# EAGLE design working (EAGLE 7.7.0)
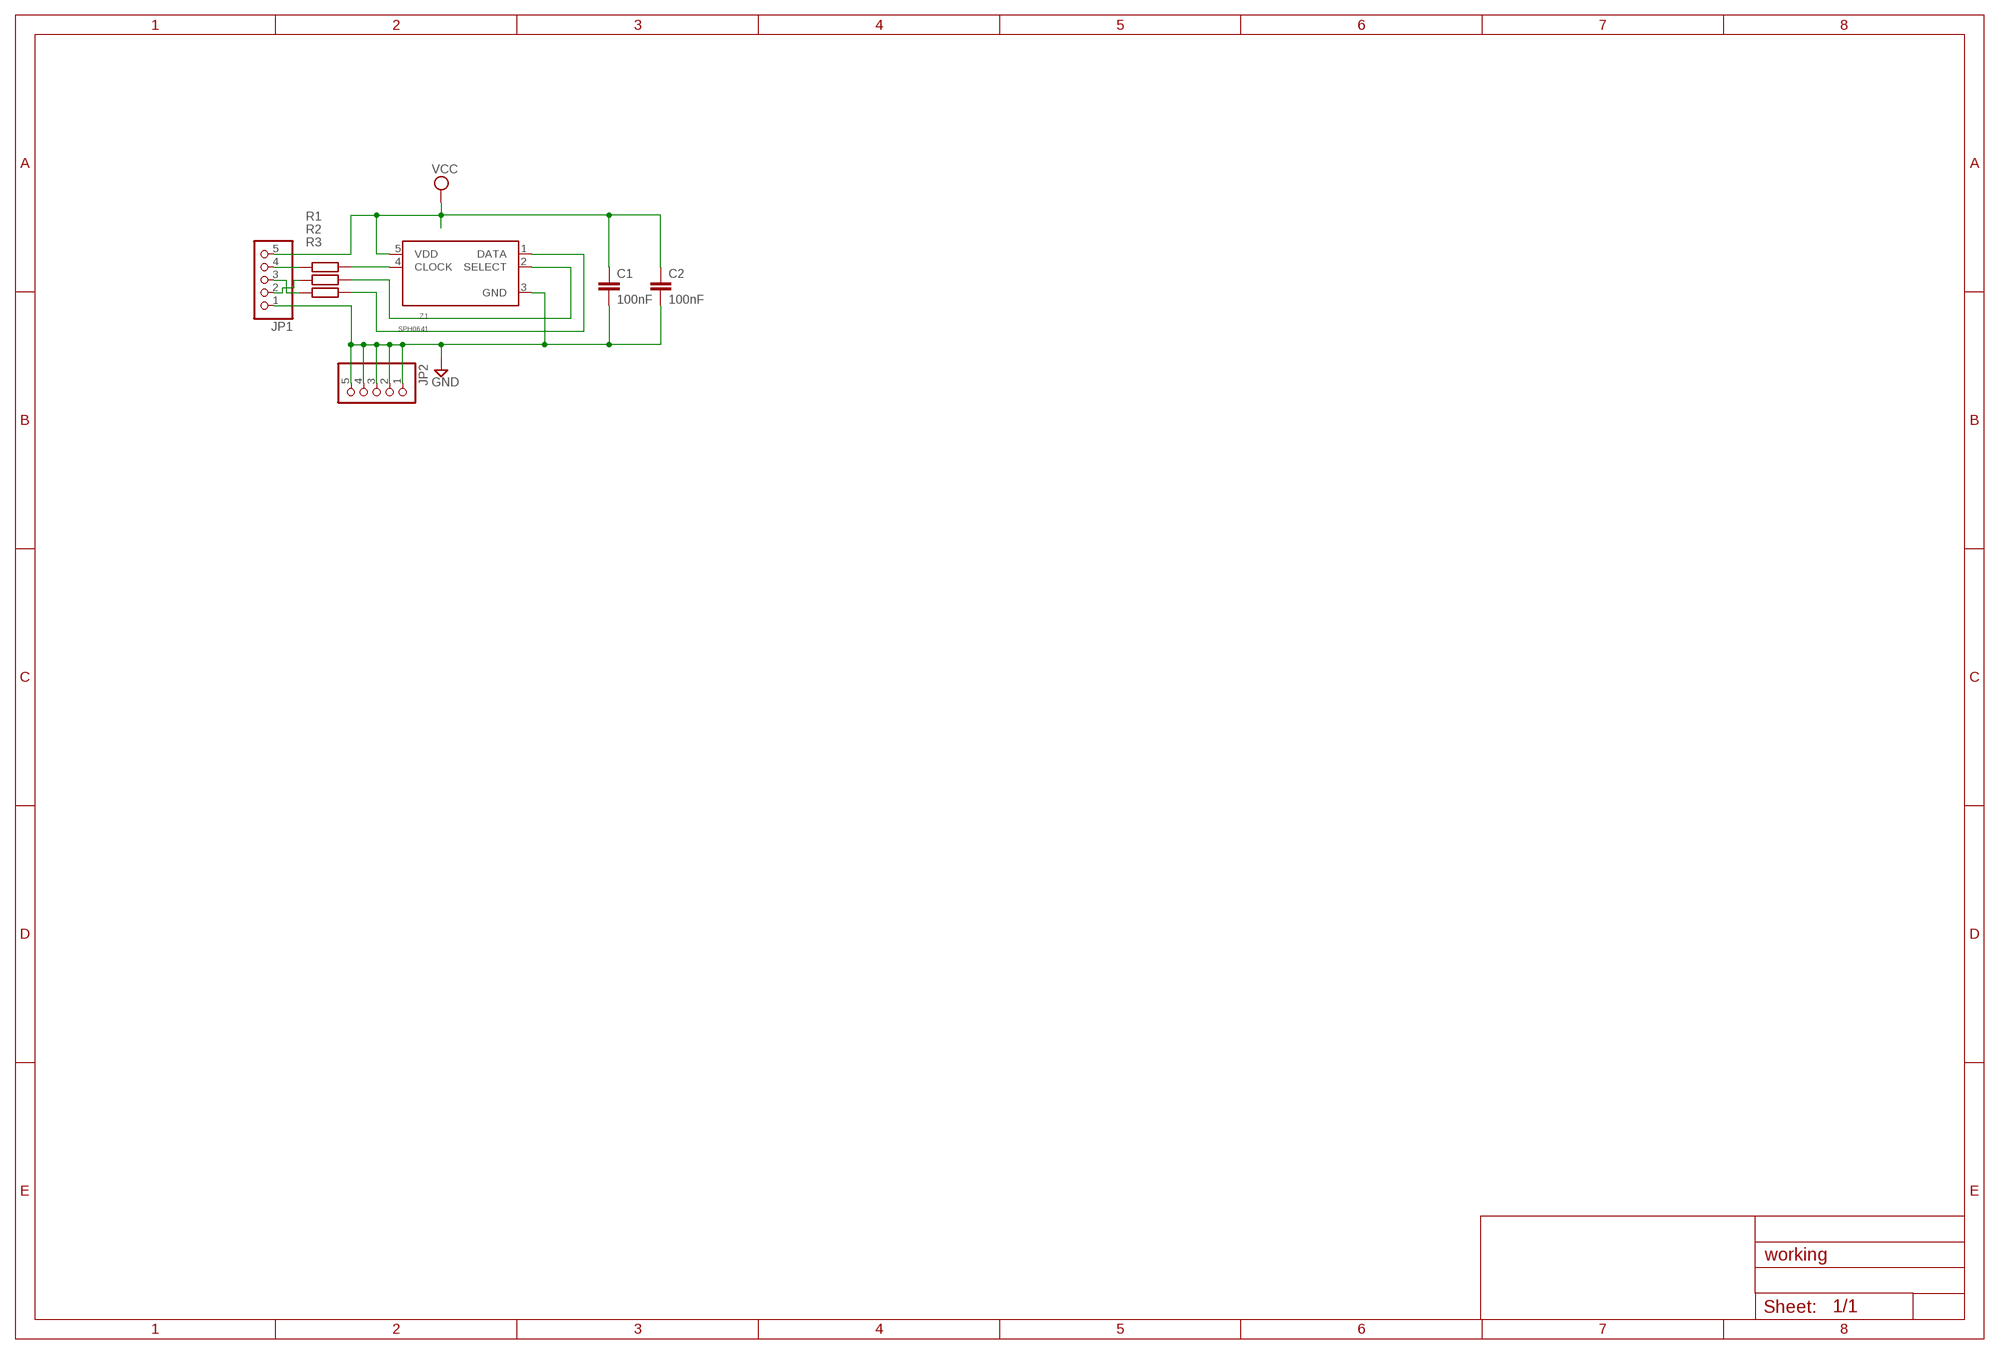
[diagram p0: schematic, sheet 1]

## Parts
C1  100nF  C-EUC0805K  [C0805K]
C2  100nF  C-EUC0805K  [C0805K]
JP1  PINHD-1X5  [1X05]
JP2  PINHD-1X5  [1X05]
R1  R-EU_R0603  [R0603]
R2  R-EU_R0603  [R0603]
R3  R-EU_R0603  [R0603]
Z1  SPH0641  [SPH0641]

## Nets
GND: C1.2 C2.2 JP1.1 JP2.1 JP2.2 JP2.3 JP2.4 JP2.5 Z1.3(GND)
N$1: JP1.4 R1.1
N$2: JP1.3 R3.1
N$3: JP1.2 R2.1
N$5: R3.2 Z1.1(DATA)
N$6: R2.2 Z1.2(SELECT)
N$7: R1.2 Z1.4(CLOCK)
VCC: C1.1 C2.1 JP1.5 Z1.5(VDD)

## Library data of the parts
C1 C2 = rcl:C-EU: CAPACITOR, European symbol
JP1 JP2 = pinhead:PINHD-1X5: PIN HEADER
R1-R3 = rcl:R-EU_: RESISTOR, European symbol
Z1 = SPH0641:SPH0641: Digital Zero-Height SiSonicTM Microphone With Multi-Mode And Ultrasonic Support

## Board
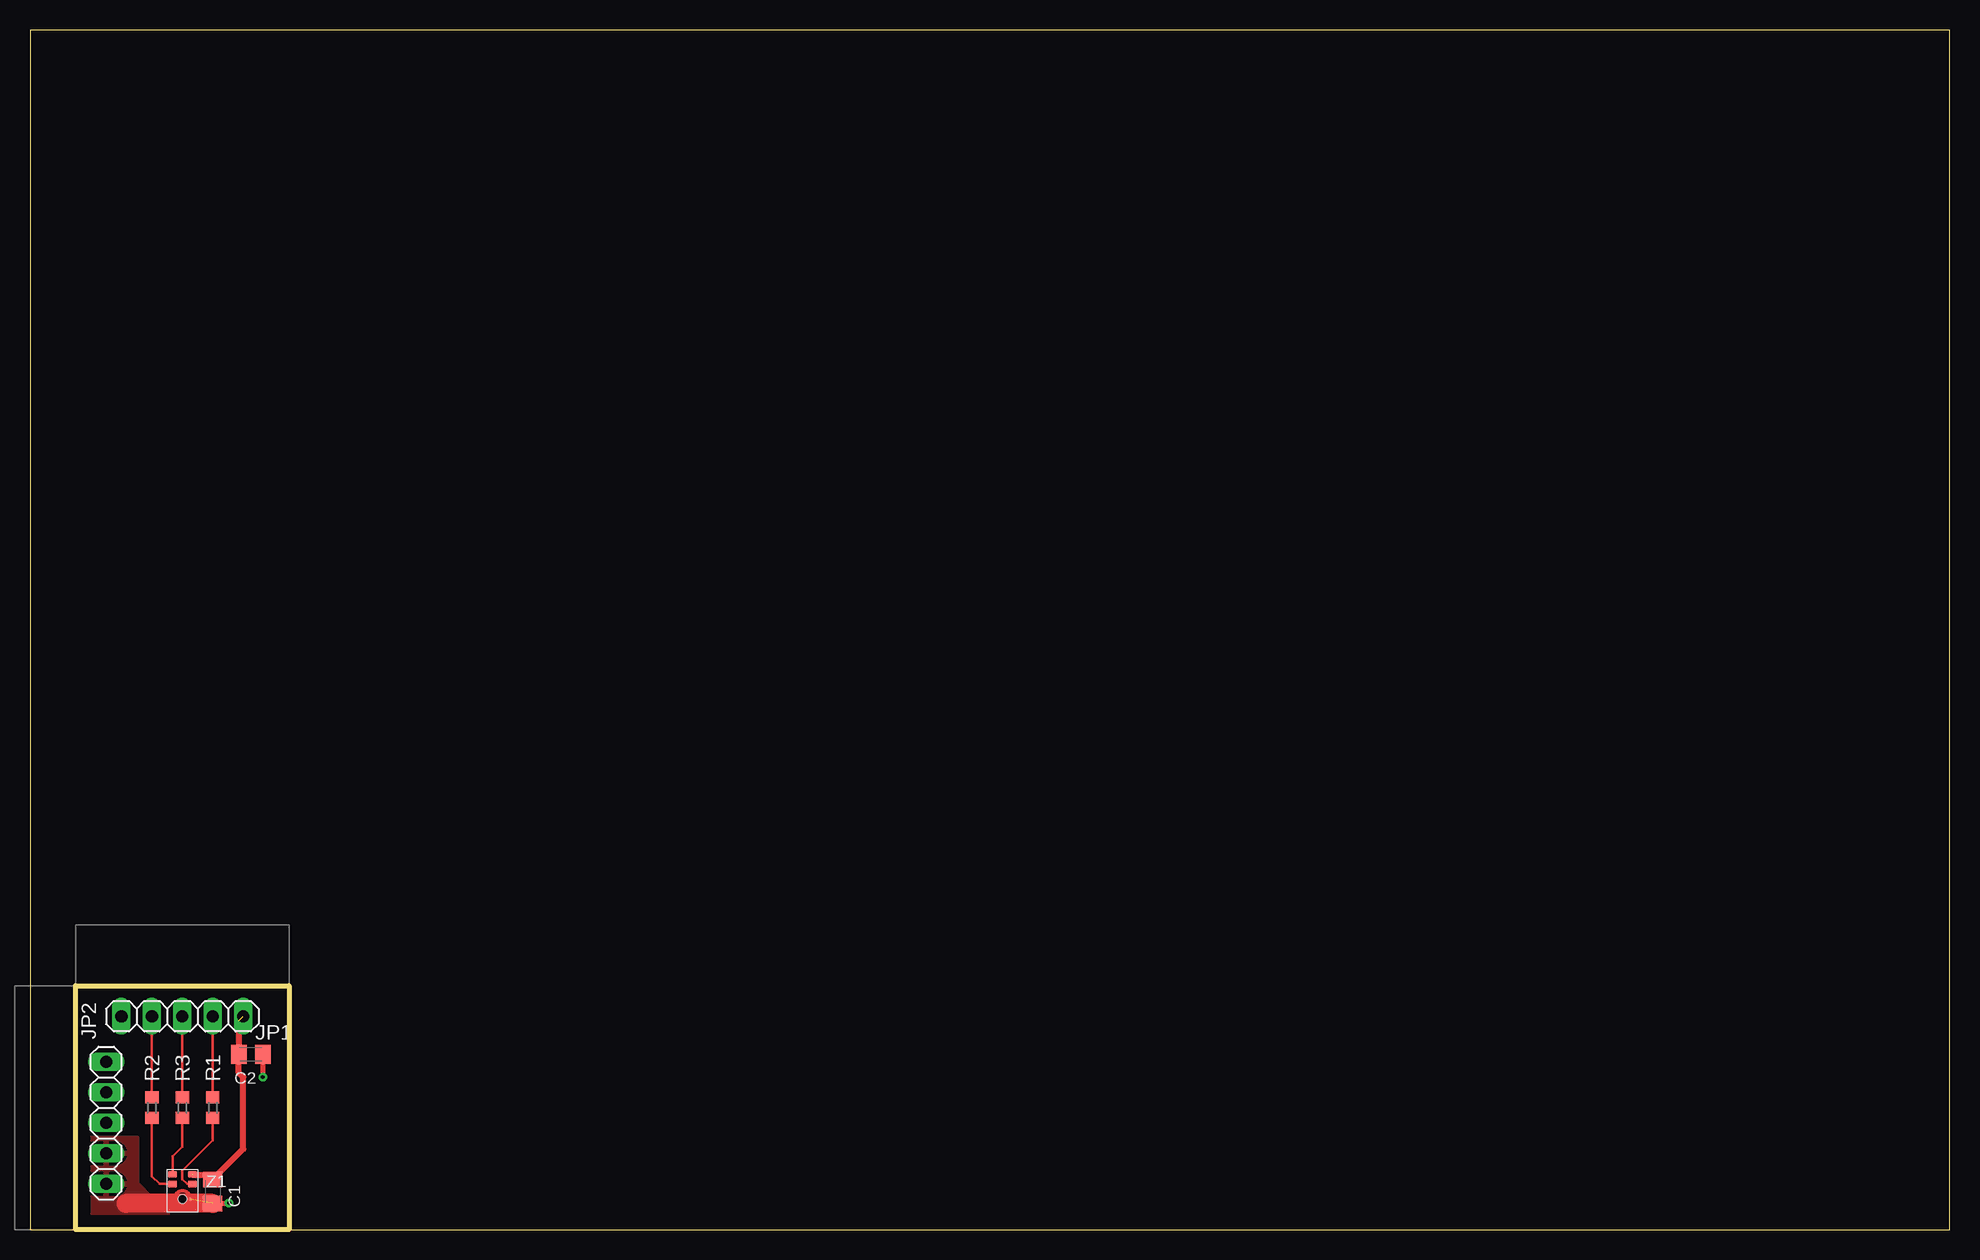
[diagram p1: board, top side]
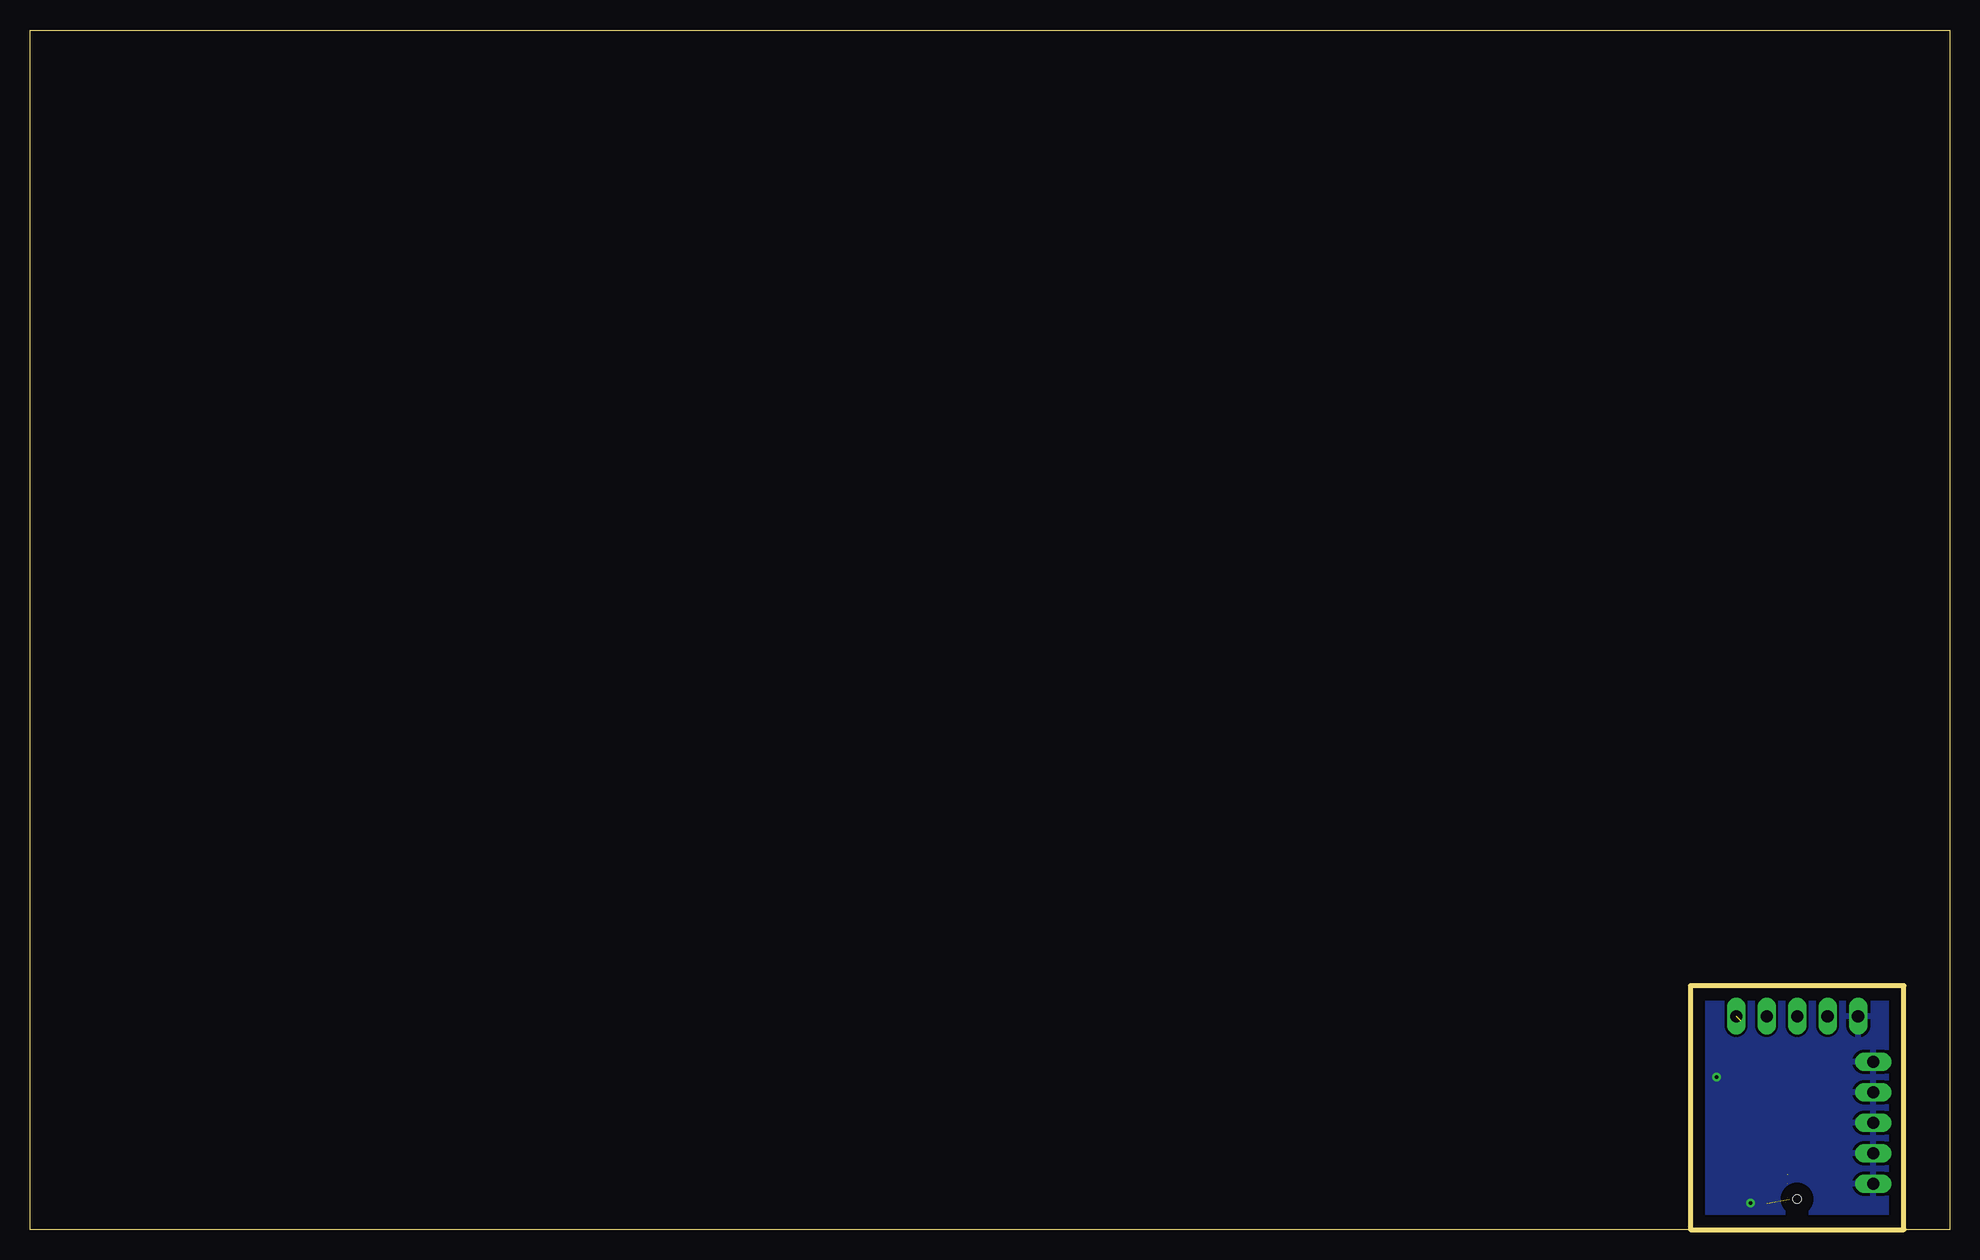
[diagram p2: board, bottom side, seen from below]

Size 160 x 100 mm. Coordinates in mm from the lower left corner, seen from the top.
Outline: 3.81,0 0,0 0,100 160,100 160,0 21.59,0
Outline: 3.81,0 3.81,20.32 21.59,20.32 21.59,0
Outline: 21.59,0 3.81,0
Copper layers (1*16): Top 0.035mm / dielectric 1.5mm / Bottom 0.035mm
Design rules "default": minimum track width 10mil, minimum drill 24mil, track to track 8mil, track to pad 8mil, pad to pad 8mil, via to via 8mil, smd to smd 8mil, copper to edge 40mil, drill to drill 8mil, minimum pad ring 10mil, minimum via ring 8mil, stop-mask expansion 4mil, vias tented up to drill 0mil, thermal gap 10mil

### Footprints (pad centres in the part's own frame; a part is rotated, then mirrored left to right if it is on the bottom)
C0805K = smd 1.3 x 1.6: 1 -1,0; 2 1,0
1X05 = drill 1.016 long: 1 -5.08,0; 2 -2.54,0; 3 0,0; 4 2.54,0; 5 5.08,0
R0603 = smd 1 x 1.1: 1 -0.85,0; 2 0.85,0
SPH0641 = smd 0.725 x 0.522: 1 -0.838,2.074; 2 -0.838,1.252; 4 0.838,1.252; 5 0.838,2.074 | smd 0.3 x 0.3: 3 0.662,0 | hole 0.7: 0,0

### Placement (x,y rotation side)
C1  15.24,3.17 270 top
C2  18.41,14.61 0 top
JP1  12.7,17.78 0 top
JP2  6.35,8.89 90 top
R1  15.24,10.16 270 top
R2  10.16,10.16 270 top
R3  12.7,10.16 270 top
Z1  12.7,2.54 0 top

### Tracks (layer width: path | path; a pad name or v marks a point on that pad's centre or on a via)
GND  (via drill 0.3 pad 0.6)  (1 unrouted)
  Top 0.406: C2.2 19.41,12.71 v19.4,12.7 | 15.27,2.2 v16.6,2.2
  Top 1.6: C1.2 7.99,2.17
  pour Bottom: 4.57,19.56 20.83,19.56 20.83,0.76 4.57,0.76
  pour Top: 5.08,7.62 8.89,7.62 8.89,3.81 10.16,2.54 11.43,2.54 11.43,0 3.81,0 3.81,7.62
N$1
  Top 0.2: JP1.4 R1.1
N$2
  Top 0.2: R3.1 JP1.3
N$3
  Top 0.2: R2.1 JP1.2
N$5
  Top 0.2: R3.2 12.7,6.9 11.9,6.1 11.9,4.65 Z1.1
N$6
  Top 0.2: R2.2 10.16,4.44 10.8,3.8 Z1.2
N$7  (1 unrouted)
  Top 0.2: Z1.4 13.1,3.8 12.7,4.2 12.7,4.9 15.24,7.44 R1.2
VCC  (2 unrouted)
  Top 0.5: 13.54,4.57 14.73,4.57 14.73,4.17 C1.1 17.78,6.71 17.78,12.7 17.41,13.06 C2.1 17.41,17.41